# EAGLE design Comparador_LM339 (EAGLE 7.5.0)
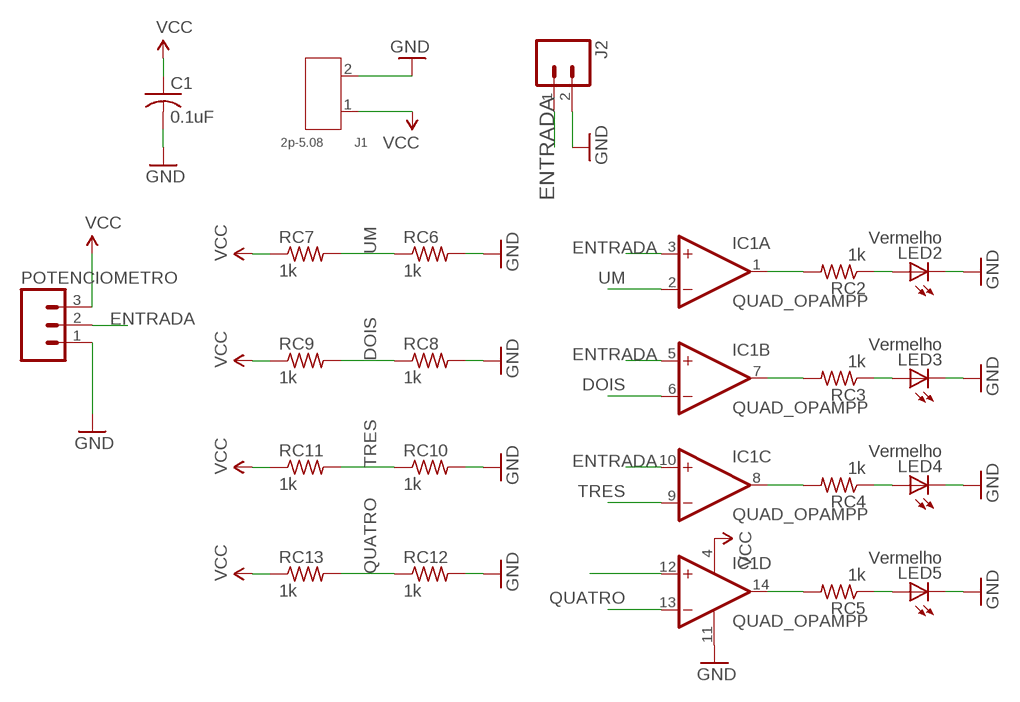
[diagram p0: schematic, sheet 1]

## Parts
C1  0.1uF  C-US050-024X044  [C050-024X044]
IC1  QUAD_OPAMPP  [DIL14]
J1  2p-5.08  DIP-BLUE-SCREW-TERMINAL(2P-5.08)  [H2-5.0-10.5X8.0MM]
J2  M02PTH  [1X02]
LED2  Vermelho  LED5MM  [LED5MM]
LED3  Vermelho  LED5MM  [LED5MM]
LED4  Vermelho  LED5MM  [LED5MM]
LED5  Vermelho  LED5MM  [LED5MM]
POTENCIOMETRO  M03-SCREW-5MM  [SCREWTERMINAL-5MM-3]
RC2  1k  R-US_0207/10  [0207/10]
RC3  1k  R-US_0207/10  [0207/10]
RC4  1k  R-US_0207/10  [0207/10]
RC5  1k  R-US_0207/10  [0207/10]
RC6  1k  R-US_0207/10  [0207/10]
RC7  1k  R-US_0207/10  [0207/10]
RC8  1k  R-US_0207/10  [0207/10]
RC9  1k  R-US_0207/10  [0207/10]
RC10  1k  R-US_0207/10  [0207/10]
RC11  1k  R-US_0207/10  [0207/10]
RC12  1k  R-US_0207/10  [0207/10]
RC13  1k  R-US_0207/10  [0207/10]

## Nets
DOIS: IC1.6(B:-IN) RC8.1 RC9.2
ENTRADA: IC1.3(A:+IN) IC1.5(B:+IN) IC1.10(C:+IN) IC1.12(D:+IN) J2.1 POTENCIOMETRO.2
GND: C1.2 IC1.11(P:V-) J1.2 J2.2 LED2.K(C) LED3.K(C) LED4.K(C) LED5.K(C) POTENCIOMETRO.1 RC6.2 RC8.2 RC10.2 RC12.2
N$1: IC1.1(A:OUT) RC2.2
N$3: IC1.7(B:OUT) RC3.2
N$7: IC1.8(C:OUT) RC4.2
N$8: IC1.14(D:OUT) RC5.2
N$9: LED2.A RC2.1
N$10: LED3.A RC3.1
N$11: LED4.A RC4.1
N$12: LED5.A RC5.1
QUATRO: IC1.13(D:-IN) RC12.1 RC13.2
TRES: IC1.9(C:-IN) RC10.1 RC11.2
UM: IC1.2(A:-IN) RC6.1 RC7.2
VCC: C1.1 IC1.4(P:V+) J1.1 POTENCIOMETRO.3 RC7.1 RC9.1 RC11.1 RC13.1

## Library data of the parts
C1 = adafruit:C-US: CAPACITOR, American symbol
IC1 = adafruit:QUAD_OPAMP: OP AMP Standard quad package
J1 = Seeed-OPL-Connector:DIP-BLUE-SCREW-TERMINAL(2P-5.08): 320110006; MPN: GS009S-2P-2
J2 = SparkFun-Connectors:M02: Standard 2-pin 0.1" header. Use with - straight break away headers ( PRT-00116) - right angle break away headers (PRT-00553) - swiss pins (PRT-00743) - machine pins (PRT-00117) - female headers (PRT-00115) Molex polarized connector foot print use with: PRT-08233 with associated crimp pins and housings. 2.54_SCREWTERM for use with PRT-10571. 3.5mm Screw Terminal footprints for PRT-08084 5mm Screw Terminal footprints for use with PRT-08432
LED2-LED5 = adafruit:LED: LED OSRAM: - CHIPLED LG R971, LG N971, LY N971, LG Q971, LY Q971, LO R971, LY R971 LH N974, LH R974 LS Q976, LO Q976, LY Q976 LO Q996 - Hyper CHIPLED LW Q18S LB Q993, LB Q99A, LB R99A - SideLED LS A670, LO A670, LY A670, LG A670, LP A670 LB A673, LV A673, LT A673, LW A673 LH A674 LY A675 LS A676, LA A676, LO A676, LY A676, LW A676 LS A679, LY A679, LG A679 - Hyper Micro SIDELED® LS Y876, LA Y876, LO Y876, LY Y876 LT Y87S - SmartLED LW L88C, LW L88S LB L89C, LB L89S, LG L890 LS L89K, LO L89K, LY L89K LS L896, LA L896, LO L896, LY L896 - TOPLED LS T670, LO T670, LY T670, LG T670, LP T670 LSG T670, LSP T670, LSY T670, LOP T670, LYG T670 LG T671, LOG T671, LSG T671 LB T673, LV T673, LT T673, LW T673 LH T674 LS T676, LA T676, LO T676, LY T676, LB T676, LH T676, LSB T676, LW T676 LB T67C, LV T67C, LT T67C, LS T67K, LO T67K, LY T67K, LW E67C LS E67B, LA E67B, LO E67B, LY E67B, LB E67C, LV E67C, LT E67C LW T67C LS T679, LY T679, LG T679 LS T770, LO T770, LY T770, LG T770, LP T770 LB T773, LV T773, LT T773, LW T773 LH T774 LS E675, LA E675, LY E675, LS T675 LS T776, LA T776, LO T776, LY T776, LB T776 LHGB T686 LT T68C, LB T68C - Hyper Mini TOPLED® LB M676 - Mini TOPLED Santana® LG M470 LS M47K, LO M47K, LY M47K Source: http://www.osram.convergy.de/
POTENCIOMETRO = SparkFun-Connectors:M03: Header 3 Standard 3-pin 0.1" header. Use with straight break away headers (SKU : PRT-00116), right angle break away headers (PRT-00553), swiss pins (PRT-00743), machine pins (PRT-00117), and female headers (PRT-00115). Molex polarized connector foot print use with SKU : PRT-08232 with associated crimp pins and housings.; STOREFRONT_ID: PRT-08433
RC2-RC13 = adafruit:R-US_: RESISTOR, American symbol

## Board
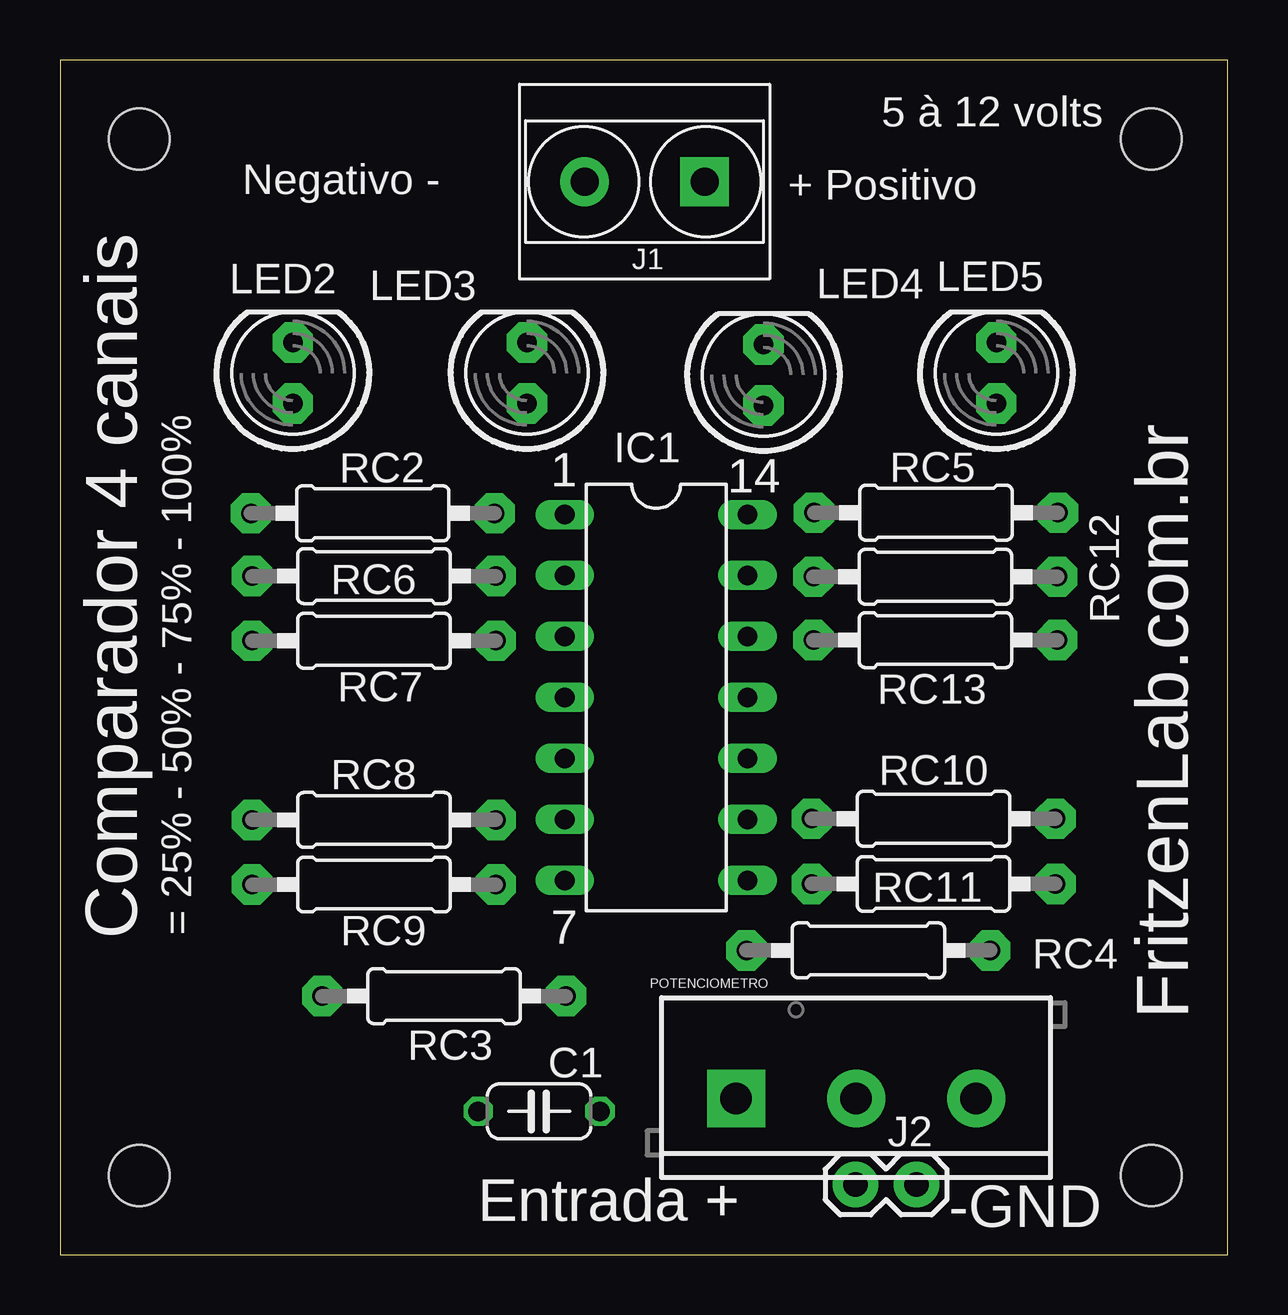
[diagram p1: board, top side]
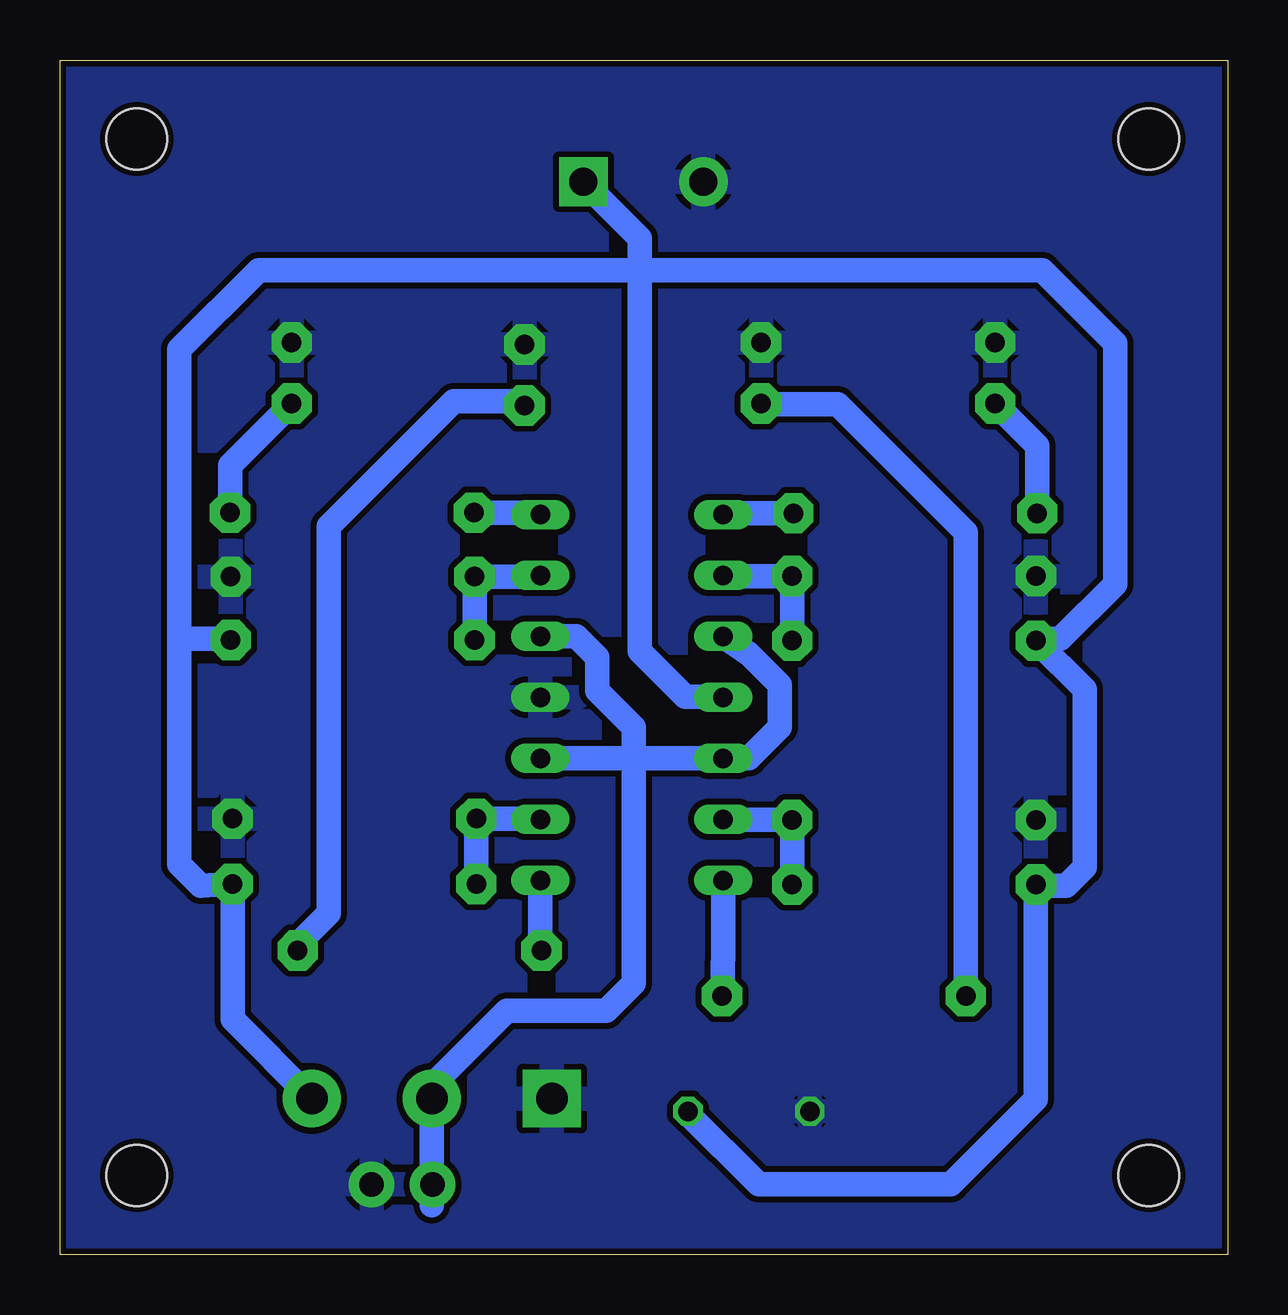
[diagram p2: board, bottom side, seen from below]

Size 48.67 x 49.77 mm. Coordinates in mm from the lower left corner, seen from the top.
Outline: 0,0 48.67,0 48.67,49.77 0,49.77 0,0
Copper layers (1*16): Top 0.035mm / dielectric 1.6mm / Bottom 0.035mm
Design rules "Elecrow_2-layer_PCB_eagle_rule *": minimum track width 6mil, minimum drill 12mil, track to track 10mil, track to pad 10mil, pad to pad 10mil, via to via 10mil, smd to smd 0mil, copper to edge 10mil, drill to drill 10mil, minimum pad ring 6mil, minimum via ring 6mil, stop-mask expansion 0mil, vias tented up to drill 100mil, thermal gap 10mil
Holes 2.54 mm at 3.3,3.3 45.47,46.48 45.47,3.3 3.3,46.48

### Footprints (pad centres in the part's own frame; a part is rotated, then mirrored left to right if it is on the bottom)
C050-024X044 = drill 0.813 octagon: 1 -2.54,0; 2 2.54,0
DIL14 = drill 0.813 long: 1 -7.62,-3.81; 2 -5.08,-3.81; 3 -2.54,-3.81; 4 0,-3.81; 5 2.54,-3.81; 6 5.08,-3.81; 7 7.62,-3.81; 8 7.62,3.81; 9 5.08,3.81; 10 2.54,3.81; 11 0,3.81; 12 -2.54,3.81; 13 -5.08,3.81; 14 -7.62,3.81
H2-5.0-10.5X8.0MM = drill 1.168 pad 2.032 square: 1 0,2.5 | drill 1.168 pad 2.032: 2 0,-2.5
1X02 = drill 1.016 pad 1.88: 1 0,0; 2 2.54,0
LED5MM = drill 0.813 pad 1.676 octagon: A -1.27,0; K 1.27,0
SCREWTERMINAL-5MM-3 = drill 1.3 pad 2.413 square: 1 0,0 | drill 1.3 pad 2.413: 2 5,0; 3 10,0
0207/10 = drill 0.813 pad 1.676 octagon: 1 -5.08,0; 2 5.08,0

### Placement (x,y rotation side)
C1  19.96,5.97 180 top
IC1  24.84,23.22 270 top
J1  24.36,44.7 270 top
J2  33.15,2.92 0 top
LED2  9.7,36.73 90 top
LED3  19.46,36.73 90 top
LED4  29.31,36.65 90 top
LED5  39.01,36.73 90 top
POTENCIOMETRO  28.17,6.5 0 top
RC2  13.03,30.89 0 top
RC3  16,10.77 0 top
RC4  33.68,12.67 180 top
RC5  36.5,30.91 180 top
RC6  13.08,28.27 180 top
RC7  13.08,25.58 0 top
RC8  13.08,18.11 180 top
RC9  13.08,15.42 0 top
RC10  36.4,18.16 0 top
RC11  36.4,15.44 180 top
RC12  36.47,28.24 0 top
RC13  36.47,25.6 180 top

### Tracks (layer width: path | path; a pad name or v marks a point on that pad's centre or on a via)
DOIS
  Bottom 1.016: IC1.6 21.01,18.11 RC8.1 RC9.2
ENTRADA
  Bottom 1.016: IC1.10 24.89,20.68 | 24.89,20.68 24.77,20.68 | 24.77,20.68 IC1.5 19.96,20.68 18.67,21.97 18.67,23.75 19.94,25.02 IC1.3 | 24.77,20.68 24.77,11.3 25.91,10.16 30.05,10.16 33.17,7.04 POTENCIOMETRO.2 33.17,2.05 J2.1 | IC1.12 27.15,25.76 26.29,24.89 26.29,23.5 24.77,21.97 24.77,20.8 24.89,20.68
GND
  pour Bottom: -0.13,-0.25 49.78,0 49.78,49.78 0,49.78
N$1
  Bottom 1.016: IC1.1 20.98,30.89 RC2.2
N$3
  Bottom 1.016: RC3.2 21.03,12.72 IC1.7
N$7
  Bottom 1.016: RC4.2 28.65,12.72 IC1.8
N$8
  Bottom 1.016: IC1.14 28.73,30.91 RC5.2
N$9
  Bottom 1.016: LED2.A 7.95,33.71 RC2.1
N$10
  Bottom 1.016: LED3.A 19.43,35.43 16.26,35.43 10.92,30.1 RC3.1
N$11
  Bottom 1.016: RC4.1 38.76,12.93 37.47,14.22 37.47,30.35 32.26,35.56 29.49,35.56 LED4.A
N$12
  Bottom 1.016: LED5.A 41.58,32.89 RC5.1
QUATRO
  Bottom 1.016: IC1.13 28.7,28.25 RC12.1 RC13.2
TRES
  Bottom 1.016: IC1.9 28.68,18.16 RC10.1 RC11.2
UM
  Bottom 1.016: IC1.2 21.01,28.27 RC6.1 RC7.2
VCC
  Bottom 1.016: J1.1 24.51,42.36 24.51,41.02 | 24.51,41.02 24.51,25.15 22.61,23.24 21.06,23.24 IC1.4 | 24.51,41.02 7.75,41.02 4.7,37.97 4.7,27.94 6.99,25.65 7.92,25.65 RC7.1 5.97,23.55 5.97,16.13 6.73,15.37 7.95,15.37 RC9.1 8,6.48 11.56,2.92 19.56,2.92 22.5,5.87 C1.1 | 43.69,25.65 43.69,16.26 42.8,15.37 RC11.1 41.48,9.81 POTENCIOMETRO.3 38.27,6.6 | 43.69,25.65 43.69,37.72 40.39,41.02 24.51,41.02 | RC13.1 41.6,25.65 43.69,25.65

### Text on the board
tNames: 5 à 12 volts | Negativo - | + Positivo | Comparador 4 canais | = 25% - 50% - 75% - 100% | 1 | 14 | 7 | FritzenLab.com.br | Entrada + | -GND